# Altium schematic sheet Motor Circuit.SchDoc
size A4; SheetNumber: 4; SheetTotal: 6
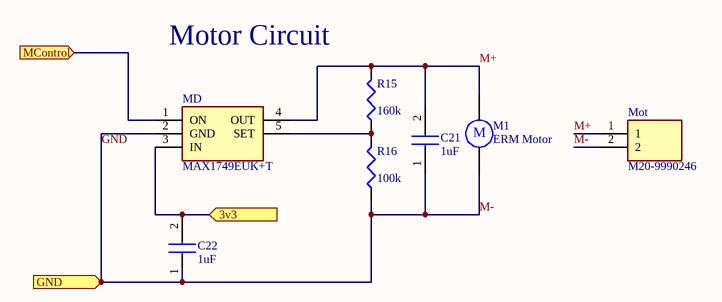
[diagram p0: Motor Circuit.SchDoc]

## Parts
C21  1uF  [CAPC1608X90N]
C22  1uF  [CAPC1608X90N]
M1  ERM Motor  [RB5-10.5]
MD  MAX1749EUK+T  [SOT95P280X145-5N]
Mot  M20-9990246  [HDRV2W66P0X254_1X2_508X254X874P]
R15  value 160k  [J1-0603]  (hidden comment: Res3)
R16  value 100k  [J1-0603]  (hidden comment: Res3)

## Ports
3v3 (in), GND (in), MControl (in)

## Nets
3v3: C22.2 MD.3(IN) ; port 3v3
GND: C21.1 C22.1 M1.2 MD.2(GND) Mot.2 R16.1 ; port GND  [also labelled M-]
M+: C21.2 M1.1 MD.4(OUT) Mot.1 R15.2
MControl: MD.1(ON) ; port MControl
NetMD_5: MD.5(SET) R15.1 R16.2

## Notes on the sheet
- (near R15) Motor Circuit
- (in symbol Motor) M

## Library data of the parts
C21 C22 = 0603YC105JAT2A: Capacitor, 0603YC10JAT2A; Manufacturer_Name: AVX; Datasheet Link: http://www.mouser.com/catalog/supplier/library/pdf/AVXSurfaceMountCeramic.pdf; Height: 0.9mm; Manufacturer_Part_Number: 0603YC105JAT2A; Mouser Part Number: 581-0603YC105JAT2A; Mouser Price/Stock: https://www.mouser.co.uk/ProductDetail/AVX/0603YC105JAT2A/?qs=RCLU9o6%252BptxSjO%252BNXwzoBQ%3D%3D; Arrow Part Number: 0603YC105JAT2A; Arrow Price/Stock: https://www.arrow.com/en/products/0603yc105jat2a/avx
M1 = Motor: VC1234B016F; Published: 24-Mar-1999; LatestRevisionDate: 17-Jul-2002; LatestRevisionNote: Re-released for DXP Platform.; PackageReference: RB5-10.5; Publisher: Altium Limited; PackageDescription: Capacitor (Radial); 2 Leads
MD = MAX1749EUK+T: Integrated Circuit; Manufacturer_Name: Maxim Integrated; Datasheet Link: https://pdfserv.maximintegrated.com/en/ds/MAX1749.pdf; Height: 1.45mm; Manufacturer_Part_Number: MAX1749EUK+T
Mot = M20-9990246: Connector; Manufacturer_Name: Harwin; Datasheet Link: https://cdn.harwin.com/pdfs/M20-999.pdf; Height: 8.74mm; Manufacturer_Part_Number: M20-9990246; Mouser Part Number: 855-M20-9990246; Mouser Price/Stock: https://www.mouser.co.uk/ProductDetail/Harwin/M20-9990246?qs=Jph8NoUxIfWjw4WmyRvzag%3D%3D
R15 R16 = Res3: Resistor; Published: 8-Jun-2000; LatestRevisionDate: 29-May-2009; LatestRevisionNote: IPC-7351 Footprint Added.; PackageReference: J1-0603; Publisher: Altium Limited; PackageDescription: Chip Resistor